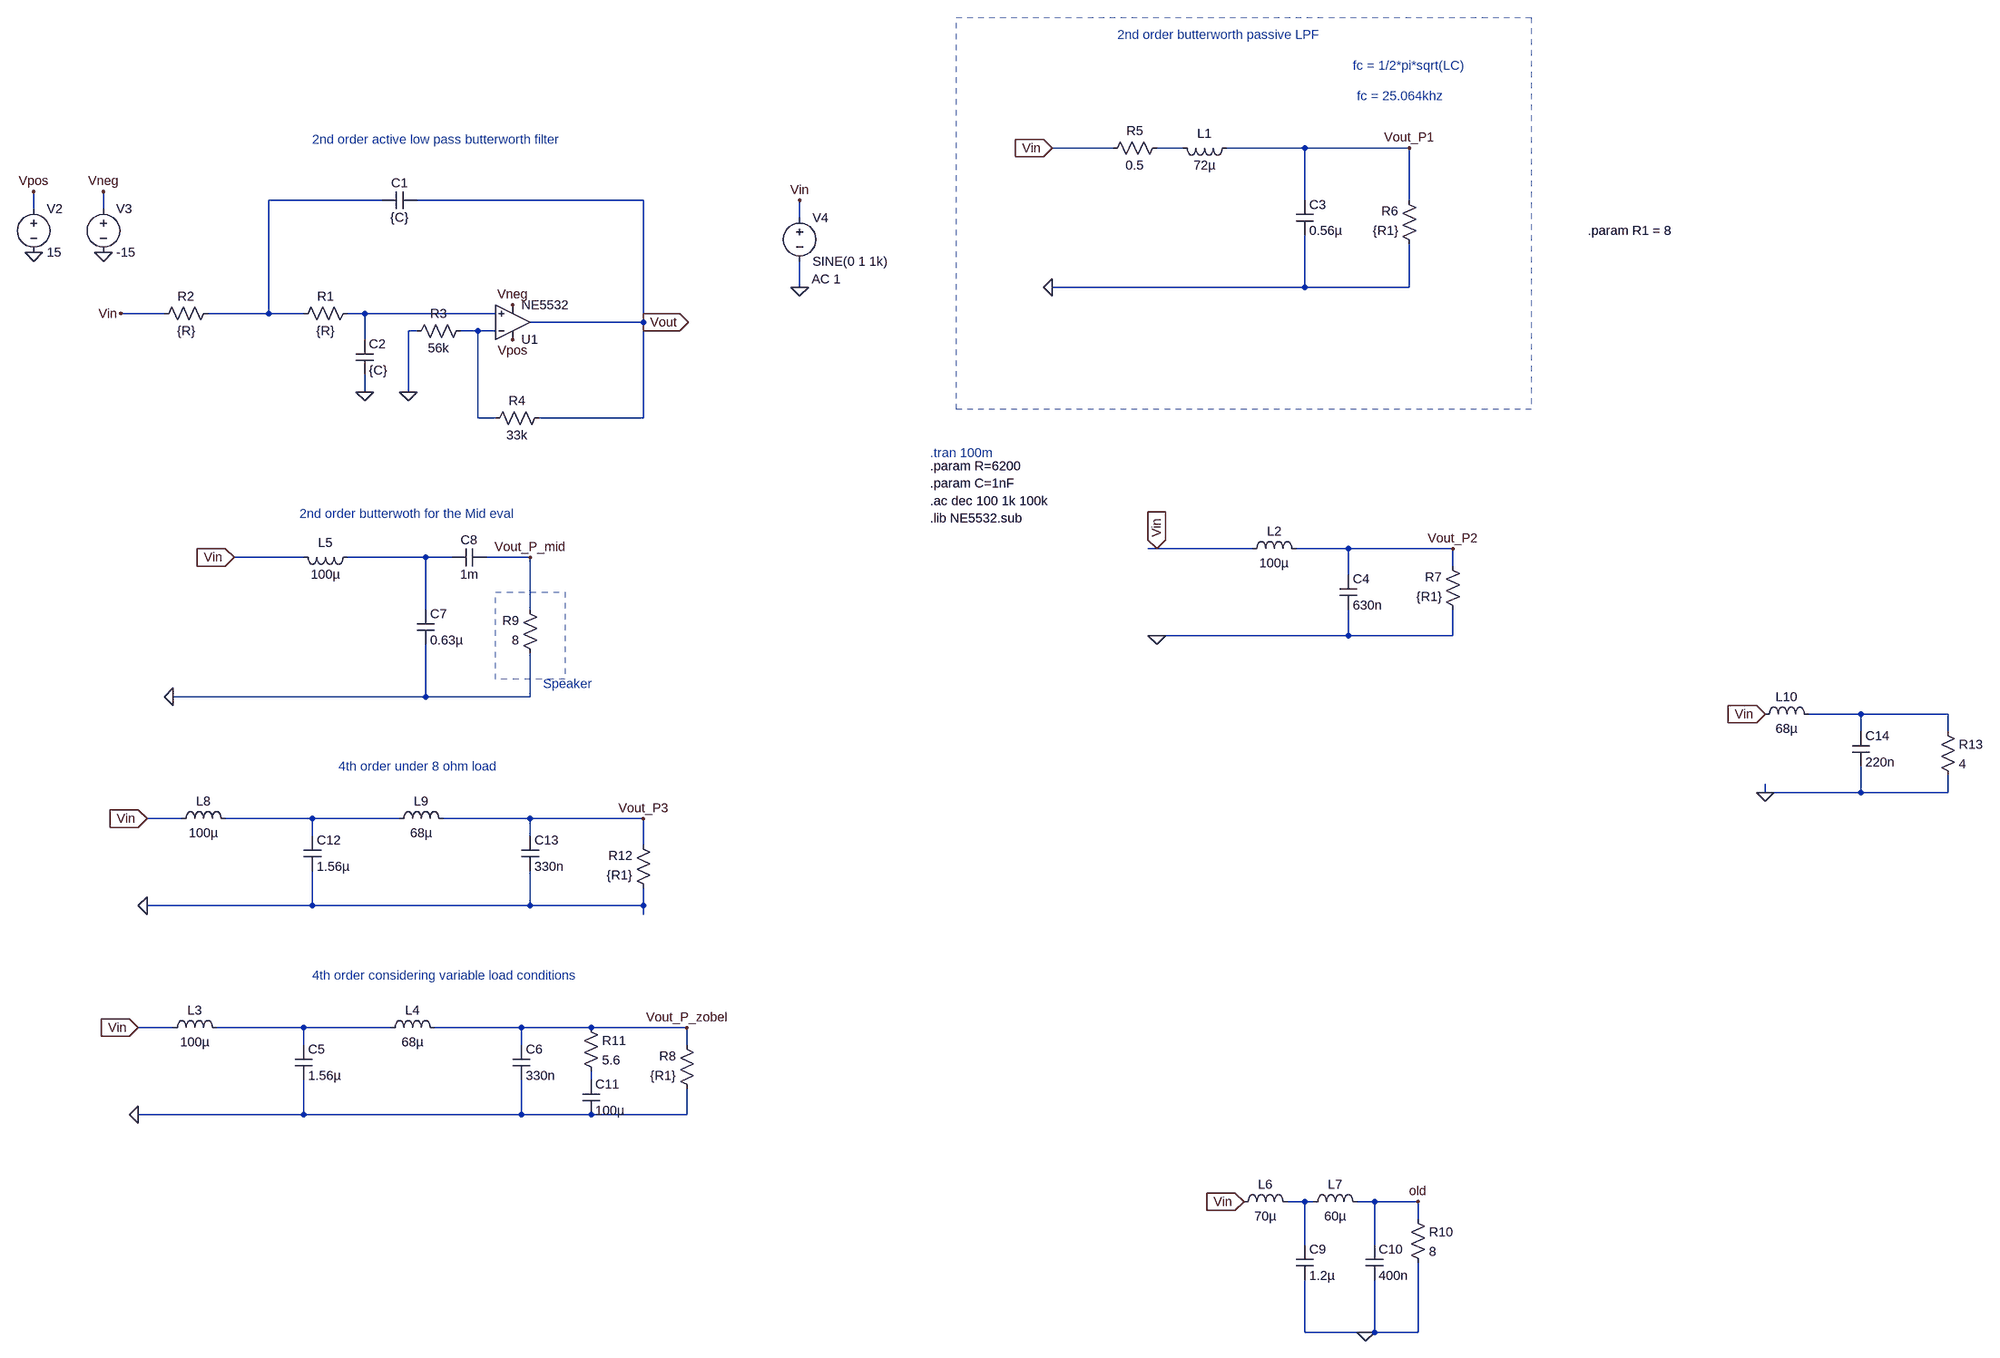
[diagram p0: schematic filter_comparison.asc]
filter_comparison.asc, the LTspice schematic file:
Version 4.1
SHEET 1 4176 2660
WIRE 1568 16 1456 16
WIRE 1696 16 1648 16
WIRE 1920 16 1776 16
WIRE 2112 16 1920 16
WIRE 80 112 -128 112
WIRE 560 112 144 112
WIRE 1920 112 1920 16
WIRE 2112 112 2112 16
WIRE -560 128 -560 96
WIRE -432 128 -432 96
WIRE 992 144 992 112
WIRE 992 272 992 224
WIRE 1920 272 1920 176
WIRE 1920 272 1456 272
WIRE 2112 272 2112 192
WIRE 2112 272 1920 272
WIRE -320 320 -400 320
WIRE -128 320 -128 112
WIRE -128 320 -240 320
WIRE -64 320 -128 320
WIRE 48 320 16 320
WIRE 288 320 48 320
WIRE 560 336 560 112
WIRE 560 336 352 336
WIRE 144 352 128 352
WIRE 256 352 224 352
WIRE 288 352 256 352
WIRE 48 368 48 320
WIRE 48 464 48 432
WIRE 128 464 128 352
WIRE 256 512 256 352
WIRE 288 512 256 512
WIRE 560 512 560 336
WIRE 560 512 368 512
WIRE 1648 752 1632 752
WIRE 1824 752 1648 752
WIRE 2000 752 1904 752
WIRE 2192 752 2000 752
WIRE -64 768 -192 768
WIRE 160 768 16 768
WIRE 208 768 160 768
WIRE 352 768 272 768
WIRE 2192 784 2192 752
WIRE 2000 800 2000 752
WIRE 160 864 160 768
WIRE 352 864 352 768
WIRE 1648 912 1632 912
WIRE 2000 912 2000 864
WIRE 2000 912 1648 912
WIRE 2192 912 2192 864
WIRE 2192 912 2000 912
WIRE 160 1024 160 928
WIRE 160 1024 -304 1024
WIRE 352 1024 352 944
WIRE 352 1024 160 1024
WIRE 3280 1056 3184 1056
WIRE 3440 1056 3280 1056
WIRE 3280 1088 3280 1056
WIRE 3440 1088 3440 1056
WIRE 3104 1200 3104 1184
WIRE 3280 1200 3280 1152
WIRE 3280 1200 3104 1200
WIRE 3440 1200 3440 1168
WIRE 3440 1200 3280 1200
WIRE -288 1248 -352 1248
WIRE -48 1248 -208 1248
WIRE 112 1248 -48 1248
WIRE 352 1248 192 1248
WIRE 560 1248 352 1248
WIRE -48 1280 -48 1248
WIRE 352 1280 352 1248
WIRE 560 1296 560 1248
WIRE -48 1408 -48 1344
WIRE -48 1408 -352 1408
WIRE 352 1408 352 1344
WIRE 352 1408 -48 1408
WIRE 560 1408 560 1376
WIRE 560 1408 352 1408
WIRE 560 1424 560 1408
WIRE -304 1632 -368 1632
WIRE -64 1632 -224 1632
WIRE 96 1632 -64 1632
WIRE 336 1632 176 1632
WIRE 464 1632 336 1632
WIRE 640 1632 464 1632
WIRE -64 1664 -64 1632
WIRE 336 1664 336 1632
WIRE 640 1664 640 1632
WIRE 464 1728 464 1712
WIRE -64 1792 -64 1728
WIRE -64 1792 -368 1792
WIRE 336 1792 336 1728
WIRE 336 1792 -64 1792
WIRE 464 1792 336 1792
WIRE 640 1792 640 1744
WIRE 640 1792 464 1792
WIRE 1920 2400 1888 2400
WIRE 1936 2400 1920 2400
WIRE 2048 2400 2016 2400
WIRE 2128 2400 2048 2400
WIRE 2128 2432 2128 2400
WIRE 1920 2480 1920 2400
WIRE 2048 2480 2048 2400
WIRE 1920 2640 1920 2544
WIRE 2032 2640 1920 2640
WIRE 2048 2640 2048 2544
WIRE 2048 2640 2032 2640
WIRE 2128 2640 2128 2512
WIRE 2128 2640 2048 2640
FLAG 128 464 0
FLAG 48 464 0
FLAG 560 336 Vout
IOPIN 560 336 Out
FLAG -400 320 Vin
FLAG -560 208 0
FLAG -432 208 0
FLAG -560 96 Vpos
FLAG -432 96 Vneg
FLAG 320 368 Vpos
FLAG 320 304 Vneg
FLAG 1456 272 0
FLAG 1456 16 Vin
IOPIN 1456 16 In
FLAG 2112 16 Vout_P1
FLAG 992 272 0
FLAG 992 112 Vin
FLAG -368 1792 0
FLAG -368 1632 Vin
IOPIN -368 1632 In
FLAG 1648 752 Vin
IOPIN 1648 752 In
FLAG 1648 912 0
FLAG 2192 752 Vout_P2
FLAG 640 1632 Vout_P_zobel
FLAG -304 1024 0
FLAG 352 768 Vout_P_mid
FLAG -192 768 Vin
IOPIN -192 768 In
FLAG 2128 2400 old
FLAG 2032 2640 0
FLAG 1808 2400 Vin
IOPIN 1808 2400 In
FLAG -352 1408 0
FLAG -352 1248 Vin
IOPIN -352 1248 In
FLAG 560 1248 Vout_P3
FLAG 3104 1056 Vin
IOPIN 3104 1056 In
FLAG 3104 1200 0
SYMBOL OpAmps\\opamp2 320 400 M180
SYMATTR InstName U1
SYMATTR Value NE5532
SYMBOL res 32 304 R90
WINDOW 0 0 56 VBottom 2
WINDOW 3 32 56 VTop 2
SYMATTR InstName R1
SYMATTR Value {R}
SYMBOL res -224 304 R90
WINDOW 0 0 56 VBottom 2
WINDOW 3 32 56 VTop 2
SYMATTR InstName R2
SYMATTR Value {R}
SYMBOL res 240 336 R90
WINDOW 0 0 56 VBottom 2
WINDOW 3 32 56 VTop 2
SYMATTR InstName R3
SYMATTR Value 56k
SYMBOL res 384 496 R90
WINDOW 0 0 56 VBottom 2
WINDOW 3 32 56 VTop 2
SYMATTR InstName R4
SYMATTR Value 33k
SYMBOL cap 144 96 R90
WINDOW 0 0 32 VBottom 2
WINDOW 3 32 32 VTop 2
SYMATTR InstName C1
SYMATTR Value {C}
SYMBOL cap 32 368 R0
SYMATTR InstName C2
SYMATTR Value {C}
SYMBOL voltage -560 112 R0
WINDOW 123 0 0 Left 0
WINDOW 39 0 0 Left 0
SYMATTR InstName V2
SYMATTR Value 15
SYMBOL voltage -432 112 R0
WINDOW 123 0 0 Left 0
WINDOW 39 0 0 Left 0
SYMATTR InstName V3
SYMATTR Value -15
SYMBOL res 1664 0 R90
WINDOW 0 0 56 VBottom 2
WINDOW 3 32 56 VTop 2
SYMATTR InstName R5
SYMATTR Value 0.5
SYMBOL res 2128 208 R180
WINDOW 0 36 76 Left 2
WINDOW 3 36 40 Left 2
SYMATTR InstName R6
SYMATTR Value {R1}
SYMBOL cap 1904 112 R0
SYMATTR InstName C3
SYMATTR Value 0.56µ
SYMBOL ind 1792 0 R90
WINDOW 0 5 56 VBottom 2
WINDOW 3 32 56 VTop 2
SYMATTR InstName L1
SYMATTR Value 72µ
SYMBOL voltage 992 128 R0
WINDOW 123 22 129 Left 2
WINDOW 39 0 0 Left 0
SYMATTR Value2 AC 1
SYMATTR InstName V4
SYMATTR Value SINE(0 1 1k)
SYMBOL ind 1808 768 R270
WINDOW 0 32 56 VTop 2
WINDOW 3 5 56 VBottom 2
SYMATTR InstName L2
SYMATTR Value 100µ
SYMATTR SpiceLine Rser=1m
SYMBOL cap 1984 800 R0
SYMATTR InstName C4
SYMATTR Value 630n
SYMBOL ind -320 1648 R270
WINDOW 0 32 56 VTop 2
WINDOW 3 5 56 VBottom 2
SYMATTR InstName L3
SYMATTR Value 100µ
SYMATTR SpiceLine Rser=1m
SYMBOL ind 80 1648 R270
WINDOW 0 32 56 VTop 2
WINDOW 3 5 56 VBottom 2
SYMATTR InstName L4
SYMATTR Value 68µ
SYMATTR SpiceLine Rser=1m
SYMBOL cap -80 1664 R0
SYMATTR InstName C5
SYMATTR Value 1.56µ
SYMBOL cap 320 1664 R0
SYMATTR InstName C6
SYMATTR Value 330n
SYMBOL res 2208 880 R180
WINDOW 0 36 76 Left 2
WINDOW 3 36 40 Left 2
SYMATTR InstName R7
SYMATTR Value {R1}
SYMBOL res 656 1760 R180
WINDOW 0 36 76 Left 2
WINDOW 3 36 40 Left 2
SYMATTR InstName R8
SYMATTR Value {R1}
SYMBOL res 368 960 R180
WINDOW 0 36 76 Left 2
WINDOW 3 36 40 Left 2
SYMATTR InstName R9
SYMATTR Value 8
SYMBOL cap 144 864 R0
SYMATTR InstName C7
SYMATTR Value 0.63µ
SYMBOL ind 32 752 R90
WINDOW 0 5 56 VBottom 2
WINDOW 3 32 56 VTop 2
SYMATTR InstName L5
SYMATTR Value 100µ
SYMATTR SpiceLine Rser=1m
SYMBOL cap 272 752 R90
WINDOW 0 0 32 VBottom 2
WINDOW 3 32 32 VTop 2
SYMATTR InstName C8
SYMATTR Value 1m
SYMBOL ind 1792 2416 R270
WINDOW 0 32 56 VTop 2
WINDOW 3 5 56 VBottom 2
SYMATTR InstName L6
SYMATTR Value 70µ
SYMATTR SpiceLine Rser=.1
SYMBOL cap 1904 2480 R0
SYMATTR InstName C9
SYMATTR Value 1.2µ
SYMBOL res 2112 2416 R0
SYMATTR InstName R10
SYMATTR Value 8
SYMBOL ind 1920 2416 R270
WINDOW 0 32 56 VTop 2
WINDOW 3 5 56 VBottom 2
SYMATTR InstName L7
SYMATTR Value 60µ
SYMATTR SpiceLine Rser=.1
SYMBOL cap 2032 2480 R0
SYMATTR InstName C10
SYMATTR Value 400n
SYMBOL cap 448 1728 R0
SYMATTR InstName C11
SYMATTR Value 100µ
SYMBOL res 448 1616 R0
SYMATTR InstName R11
SYMATTR Value 5.6
SYMBOL ind -304 1264 R270
WINDOW 0 32 56 VTop 2
WINDOW 3 5 56 VBottom 2
SYMATTR InstName L8
SYMATTR Value 100µ
SYMATTR SpiceLine Rser=1m
SYMBOL ind 96 1264 R270
WINDOW 0 32 56 VTop 2
WINDOW 3 5 56 VBottom 2
SYMATTR InstName L9
SYMATTR Value 68µ
SYMATTR SpiceLine Rser=1m
SYMBOL cap -64 1280 R0
SYMATTR InstName C12
SYMATTR Value 1.56µ
SYMBOL cap 336 1280 R0
SYMATTR InstName C13
SYMATTR Value 330n
SYMBOL res 576 1392 R180
WINDOW 0 36 76 Left 2
WINDOW 3 36 40 Left 2
SYMATTR InstName R12
SYMATTR Value {R1}
SYMBOL ind 3088 1072 R270
WINDOW 0 32 56 VTop 2
WINDOW 3 5 56 VBottom 2
SYMATTR InstName L10
SYMATTR Value 68µ
SYMATTR SpiceLine Rser=1m
SYMBOL cap 3264 1088 R0
SYMATTR InstName C14
SYMATTR Value 220n
SYMBOL res 3424 1072 R0
SYMATTR InstName R13
SYMATTR Value 4
TEXT 1232 600 Left 2 !.param R=6200
TEXT 1232 632 Left 2 !.param C=1nF
TEXT 1232 576 Left 2 ;.tran 100m
TEXT 1232 664 Left 2 !.ac dec 100 1k 100k
TEXT 1232 696 Left 2 !.lib NE5532.sub
TEXT -48 0 Left 2 ;2nd order active low pass butterworth filter
TEXT 1576 -192 Left 2 ;2nd order butterworth passive LPF
TEXT 2688 168 Left 2 !.param R1 = 8
TEXT 2008 -136 Left 2 ;fc = 1/2*pi*sqrt(LC)
TEXT 2016 -80 Left 2 ;fc = 25.064khz
TEXT 376 1000 Left 2 ;Speaker
TEXT -72 688 Left 2 ;2nd order butterwoth for the Mid eval
TEXT 0 1152 Left 2 ;4th order under 8 ohm load
TEXT -48 1536 Left 2 ;4th order considering variable load conditions
RECTANGLE Normal 2336 496 1280 -224 2
RECTANGLE Normal 416 992 288 832 2

The netlist it stands for:
* filter_comparison.asc
X§U1 N003 N004 Vpos Vneg Vout NE5532  ; pins In+ In- V+ V- OUT
R1 N003 N002 {R}
R2 N002 Vin {R}
R3 N004 0 56k
R4 Vout N004 33k
C1 Vout N002 {C}
C2 N003 0 {C}
V2 Vpos 0 15
V3 Vneg 0 -15
R5 N001 Vin 0.5
R6 0 Vout_P1 {R1}
C3 Vout_P1 0 0.56µ
L1 Vout_P1 N001 72µ
V4 Vin 0 SINE(0 1 1k) AC 1
L2 Vin Vout_P2 100µ Rser=1m
C4 Vout_P2 0 630n
L3 Vin N008 100µ Rser=1m
L4 N008 Vout_P_zobel 68µ Rser=1m
C5 N008 0 1.56µ
C6 Vout_P_zobel 0 330n
R7 0 Vout_P2 {R1}
R8 0 Vout_P_zobel {R1}
R9 0 Vout_P_mid 8
C7 N005 0 0.63µ
L5 N005 Vin 100µ Rser=1m
C8 Vout_P_mid N005 1m
L6 Vin N010 70µ Rser=.1
C9 N010 0 1.2µ
R10 old 0 8
L7 N010 old 60µ Rser=.1
C10 old 0 400n
C11 N009 0 100µ
R11 Vout_P_zobel N009 5.6
L8 Vin N007 100µ Rser=1m
L9 N007 Vout_P3 68µ Rser=1m
C12 N007 0 1.56µ
C13 Vout_P3 0 330n
R12 0 Vout_P3 {R1}
L10 Vin N006 68µ Rser=1m
C14 N006 0 220n
R13 N006 0 4
.param R=6200
.param C=1nF
* .tran 100m
.ac dec 100 1k 100k
.lib NE5532.sub
* 2nd order active low pass butterworth filter
* 2nd order butterworth passive LPF
.param R1 = 8
* fc = 1/2*pi*sqrt(LC)
* fc = 25.064khz
* Speaker
* 2nd order butterwoth for the Mid eval
* 4th order under 8 ohm load
* 4th order considering variable load conditions
.backanno
.end